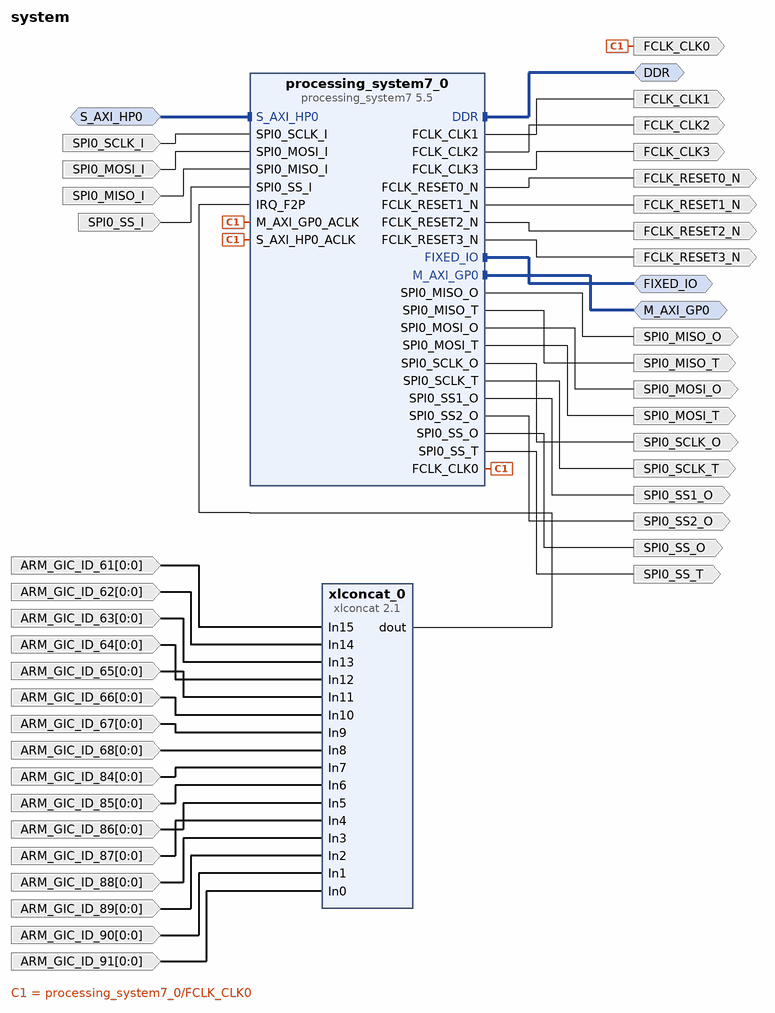
[diagram p0: block diagram of the top level]
# Vivado block design system, Vivado 2015.4
create_bd_design system

create_bd_intf_port -mode Master -vlnv xilinx.com:interface:ddrx_rtl:1.0 DDR
create_bd_intf_port -mode Master -vlnv xilinx.com:display_processing_system7:fixedio_rtl:1.0 FIXED_IO
create_bd_intf_port -mode Master -vlnv xilinx.com:interface:aximm_rtl:1.0 M_AXI_GP0
set_property -dict {CONFIG.DATA_WIDTH 32 CONFIG.PROTOCOL AXI3 CONFIG.ADDR_WIDTH 32} [get_bd_intf_ports M_AXI_GP0]
create_bd_intf_port -mode Slave -vlnv xilinx.com:interface:aximm_rtl:1.0 S_AXI_HP0
set_property -dict [list \
  CONFIG.DATA_WIDTH 64 \
  CONFIG.PROTOCOL AXI3 \
  CONFIG.ID_WIDTH 6 \
  CONFIG.ADDR_WIDTH 32 \
  CONFIG.AWUSER_WIDTH 0 \
  CONFIG.ARUSER_WIDTH 0 \
  CONFIG.WUSER_WIDTH 0 \
  CONFIG.RUSER_WIDTH 0 \
  CONFIG.BUSER_WIDTH 0 \
  CONFIG.READ_WRITE_MODE READ_WRITE \
  CONFIG.HAS_BURST 1 \
  CONFIG.HAS_LOCK 1 \
  CONFIG.HAS_PROT 1 \
  CONFIG.HAS_CACHE 1 \
  CONFIG.HAS_QOS 1 \
  CONFIG.HAS_REGION 1 \
  CONFIG.HAS_WSTRB 1 \
  CONFIG.HAS_BRESP 1 \
  CONFIG.HAS_RRESP 1 \
  CONFIG.SUPPORTS_NARROW_BURST 1 \
  CONFIG.NUM_READ_OUTSTANDING 8 \
  CONFIG.NUM_WRITE_OUTSTANDING 8 \
  CONFIG.MAX_BURST_LENGTH 16 \
] [get_bd_intf_ports S_AXI_HP0]
create_bd_port -dir O -type clk FCLK_CLK0
set_property -dict {CONFIG.ASSOCIATED_BUSIF M_AXI_GP0:S_AXI_HP0} [get_bd_ports FCLK_CLK0]
create_bd_port -dir O -type clk FCLK_CLK1
create_bd_port -dir O -type clk FCLK_CLK2
create_bd_port -dir O -type clk FCLK_CLK3
create_bd_port -dir O -type rst FCLK_RESET0_N
create_bd_port -dir O -type rst FCLK_RESET1_N
create_bd_port -dir O -type rst FCLK_RESET2_N
create_bd_port -dir O -type rst FCLK_RESET3_N
create_bd_port -dir I SPI0_SCLK_I
create_bd_port -dir O SPI0_SCLK_O
create_bd_port -dir O SPI0_SCLK_T
create_bd_port -dir I SPI0_MOSI_I
create_bd_port -dir O SPI0_MOSI_O
create_bd_port -dir O SPI0_MOSI_T
create_bd_port -dir I SPI0_MISO_I
create_bd_port -dir O SPI0_MISO_O
create_bd_port -dir O SPI0_MISO_T
create_bd_port -dir I SPI0_SS_I
create_bd_port -dir O SPI0_SS_O
create_bd_port -dir O SPI0_SS1_O
create_bd_port -dir O SPI0_SS2_O
create_bd_port -dir O SPI0_SS_T
create_bd_port -dir I -from 0 -to 0 ARM_GIC_ID_61
create_bd_port -dir I -from 0 -to 0 ARM_GIC_ID_62
create_bd_port -dir I -from 0 -to 0 ARM_GIC_ID_63
create_bd_port -dir I -from 0 -to 0 ARM_GIC_ID_64
create_bd_port -dir I -from 0 -to 0 ARM_GIC_ID_65
create_bd_port -dir I -from 0 -to 0 ARM_GIC_ID_66
create_bd_port -dir I -from 0 -to 0 ARM_GIC_ID_67
create_bd_port -dir I -from 0 -to 0 ARM_GIC_ID_68
create_bd_port -dir I -from 0 -to 0 ARM_GIC_ID_84
create_bd_port -dir I -from 0 -to 0 ARM_GIC_ID_85
create_bd_port -dir I -from 0 -to 0 ARM_GIC_ID_86
create_bd_port -dir I -from 0 -to 0 ARM_GIC_ID_87
create_bd_port -dir I -from 0 -to 0 ARM_GIC_ID_88
create_bd_port -dir I -from 0 -to 0 ARM_GIC_ID_89
create_bd_port -dir I -from 0 -to 0 ARM_GIC_ID_90
create_bd_port -dir I -from 0 -to 0 ARM_GIC_ID_91

create_bd_cell -type ip -vlnv xilinx.com:ip:processing_system7:5.5 processing_system7_0
set_property -dict [list \
  CONFIG.PCW_QSPI_PERIPHERAL_FREQMHZ 125 \
  CONFIG.PCW_FPGA0_PERIPHERAL_FREQMHZ 125 \
  CONFIG.PCW_FPGA1_PERIPHERAL_FREQMHZ 250 \
  CONFIG.PCW_FPGA3_PERIPHERAL_FREQMHZ 200 \
  CONFIG.PCW_USE_S_AXI_HP0 1 \
  CONFIG.PCW_USE_FABRIC_INTERRUPT 1 \
  CONFIG.PCW_EN_CLK1_PORT 1 \
  CONFIG.PCW_EN_CLK2_PORT 1 \
  CONFIG.PCW_EN_CLK3_PORT 1 \
  CONFIG.PCW_EN_RST1_PORT 1 \
  CONFIG.PCW_EN_RST2_PORT 1 \
  CONFIG.PCW_EN_RST3_PORT 1 \
  CONFIG.PCW_IRQ_F2P_INTR 1 \
  CONFIG.PCW_PRESET_BANK1_VOLTAGE {LVCMOS 2.5V} \
  CONFIG.PCW_UIPARAM_DDR_BUS_WIDTH {16 Bit} \
  CONFIG.PCW_UIPARAM_DDR_PARTNO {MT41J256M16 RE-125} \
  CONFIG.PCW_QSPI_PERIPHERAL_ENABLE 1 \
  CONFIG.PCW_QSPI_GRP_SINGLE_SS_ENABLE 1 \
  CONFIG.PCW_ENET0_PERIPHERAL_ENABLE 1 \
  CONFIG.PCW_ENET0_ENET0_IO {MIO 16 .. 27} \
  CONFIG.PCW_ENET0_GRP_MDIO_ENABLE 1 \
  CONFIG.PCW_SD0_PERIPHERAL_ENABLE 1 \
  CONFIG.PCW_SD0_GRP_CD_ENABLE 1 \
  CONFIG.PCW_SD0_GRP_CD_IO {MIO 46} \
  CONFIG.PCW_SD0_GRP_WP_ENABLE 1 \
  CONFIG.PCW_SD0_GRP_WP_IO {MIO 47} \
  CONFIG.PCW_UART0_PERIPHERAL_ENABLE 1 \
  CONFIG.PCW_UART0_UART0_IO {MIO 14 .. 15} \
  CONFIG.PCW_UART1_PERIPHERAL_ENABLE 1 \
  CONFIG.PCW_UART1_UART1_IO {MIO 8 .. 9} \
  CONFIG.PCW_SPI0_PERIPHERAL_ENABLE 1 \
  CONFIG.PCW_SPI1_PERIPHERAL_ENABLE 1 \
  CONFIG.PCW_SPI1_SPI1_IO {MIO 10 .. 15} \
  CONFIG.PCW_TTC0_PERIPHERAL_ENABLE 1 \
  CONFIG.PCW_USB0_PERIPHERAL_ENABLE 1 \
  CONFIG.PCW_USB0_RESET_ENABLE 1 \
  CONFIG.PCW_USB0_RESET_IO {MIO 48} \
  CONFIG.PCW_I2C0_PERIPHERAL_ENABLE 1 \
  CONFIG.PCW_I2C0_I2C0_IO {MIO 50 .. 51} \
  CONFIG.PCW_GPIO_MIO_GPIO_ENABLE 1 \
] [get_bd_cells processing_system7_0]
# 50 more settings of processing_system7_0 are not shown: defaults, MIO pin electricals, DDR timing, and values the tool derives
create_bd_cell -type ip -vlnv xilinx.com:ip:xlconcat:2.1 xlconcat_0
set_property -dict {CONFIG.NUM_PORTS 16} [get_bd_cells xlconcat_0]

# ---- connections ----

connect_bd_intf_net [get_bd_intf_ports DDR] [get_bd_intf_pins processing_system7_0/DDR]
connect_bd_intf_net [get_bd_intf_ports FIXED_IO] [get_bd_intf_pins processing_system7_0/FIXED_IO]
connect_bd_intf_net [get_bd_intf_ports M_AXI_GP0] [get_bd_intf_pins processing_system7_0/M_AXI_GP0]
connect_bd_intf_net -intf_net s_axi_hp0_1 [get_bd_intf_ports S_AXI_HP0] [get_bd_intf_pins processing_system7_0/S_AXI_HP0]
connect_bd_net [get_bd_pins processing_system7_0/FCLK_CLK0] \
  [get_bd_ports FCLK_CLK0] [get_bd_pins processing_system7_0/M_AXI_GP0_ACLK] \
  [get_bd_pins processing_system7_0/S_AXI_HP0_ACLK]
connect_bd_net [get_bd_pins processing_system7_0/FCLK_CLK1] [get_bd_ports FCLK_CLK1]
connect_bd_net [get_bd_pins processing_system7_0/FCLK_CLK2] [get_bd_ports FCLK_CLK2]
connect_bd_net [get_bd_pins processing_system7_0/FCLK_CLK3] [get_bd_ports FCLK_CLK3]
connect_bd_net [get_bd_pins processing_system7_0/FCLK_RESET0_N] [get_bd_ports FCLK_RESET0_N]
connect_bd_net [get_bd_pins processing_system7_0/FCLK_RESET1_N] [get_bd_ports FCLK_RESET1_N]
connect_bd_net [get_bd_pins processing_system7_0/FCLK_RESET2_N] [get_bd_ports FCLK_RESET2_N]
connect_bd_net [get_bd_pins processing_system7_0/FCLK_RESET3_N] [get_bd_ports FCLK_RESET3_N]
connect_bd_net [get_bd_ports SPI0_SCLK_I] [get_bd_pins processing_system7_0/SPI0_SCLK_I]
connect_bd_net [get_bd_pins processing_system7_0/SPI0_SCLK_O] [get_bd_ports SPI0_SCLK_O]
connect_bd_net [get_bd_pins processing_system7_0/SPI0_SCLK_T] [get_bd_ports SPI0_SCLK_T]
connect_bd_net [get_bd_ports SPI0_MOSI_I] [get_bd_pins processing_system7_0/SPI0_MOSI_I]
connect_bd_net [get_bd_pins processing_system7_0/SPI0_MOSI_O] [get_bd_ports SPI0_MOSI_O]
connect_bd_net [get_bd_pins processing_system7_0/SPI0_MOSI_T] [get_bd_ports SPI0_MOSI_T]
connect_bd_net [get_bd_ports SPI0_MISO_I] [get_bd_pins processing_system7_0/SPI0_MISO_I]
connect_bd_net [get_bd_pins processing_system7_0/SPI0_MISO_O] [get_bd_ports SPI0_MISO_O]
connect_bd_net [get_bd_pins processing_system7_0/SPI0_MISO_T] [get_bd_ports SPI0_MISO_T]
connect_bd_net [get_bd_ports SPI0_SS_I] [get_bd_pins processing_system7_0/SPI0_SS_I]
connect_bd_net [get_bd_pins processing_system7_0/SPI0_SS_O] [get_bd_ports SPI0_SS_O]
connect_bd_net [get_bd_pins processing_system7_0/SPI0_SS1_O] [get_bd_ports SPI0_SS1_O]
connect_bd_net [get_bd_pins processing_system7_0/SPI0_SS2_O] [get_bd_ports SPI0_SS2_O]
connect_bd_net [get_bd_pins processing_system7_0/SPI0_SS_T] [get_bd_ports SPI0_SS_T]
connect_bd_net [get_bd_pins xlconcat_0/dout] [get_bd_pins processing_system7_0/IRQ_F2P]
connect_bd_net -net arm_gic_id_61_1 [get_bd_ports ARM_GIC_ID_61] [get_bd_pins xlconcat_0/In15]
connect_bd_net -net arm_gic_id_62_1 [get_bd_ports ARM_GIC_ID_62] [get_bd_pins xlconcat_0/In14]
connect_bd_net -net arm_gic_id_63_1 [get_bd_ports ARM_GIC_ID_63] [get_bd_pins xlconcat_0/In13]
connect_bd_net -net arm_gic_id_64_1 [get_bd_ports ARM_GIC_ID_64] [get_bd_pins xlconcat_0/In12]
connect_bd_net -net arm_gic_id_65_1 [get_bd_ports ARM_GIC_ID_65] [get_bd_pins xlconcat_0/In11]
connect_bd_net -net arm_gic_id_66_1 [get_bd_ports ARM_GIC_ID_66] [get_bd_pins xlconcat_0/In10]
connect_bd_net -net arm_gic_id_67_1 [get_bd_ports ARM_GIC_ID_67] [get_bd_pins xlconcat_0/In9]
connect_bd_net -net arm_gic_id_68_1 [get_bd_ports ARM_GIC_ID_68] [get_bd_pins xlconcat_0/In8]
connect_bd_net -net arm_gic_id_84_1 [get_bd_ports ARM_GIC_ID_84] [get_bd_pins xlconcat_0/In7]
connect_bd_net -net arm_gic_id_85_1 [get_bd_ports ARM_GIC_ID_85] [get_bd_pins xlconcat_0/In6]
connect_bd_net -net arm_gic_id_86_1 [get_bd_ports ARM_GIC_ID_86] [get_bd_pins xlconcat_0/In5]
connect_bd_net -net arm_gic_id_87_1 [get_bd_ports ARM_GIC_ID_87] [get_bd_pins xlconcat_0/In4]
connect_bd_net -net arm_gic_id_88_1 [get_bd_ports ARM_GIC_ID_88] [get_bd_pins xlconcat_0/In3]
connect_bd_net -net arm_gic_id_89_1 [get_bd_ports ARM_GIC_ID_89] [get_bd_pins xlconcat_0/In2]
connect_bd_net -net arm_gic_id_90_1 [get_bd_ports ARM_GIC_ID_90] [get_bd_pins xlconcat_0/In1]
connect_bd_net -net arm_gic_id_91_1 [get_bd_ports ARM_GIC_ID_91] [get_bd_pins xlconcat_0/In0]

# ---- address map ----
assign_bd_address -offset 0x40000000 -range 1G -target_address_space [get_bd_addr_spaces processing_system7_0/Data] [get_bd_addr_segs M_AXI_GP0/Reg]
assign_bd_address -offset 0x00000000 -range 512M -target_address_space [get_bd_addr_spaces S_AXI_HP0] [get_bd_addr_segs processing_system7_0/S_AXI_HP0/HP0_DDR_LOWOCM]

validate_bd_design
save_bd_design
